# EAGLE design FM-Super-Regen (EAGLE 7.7.0)
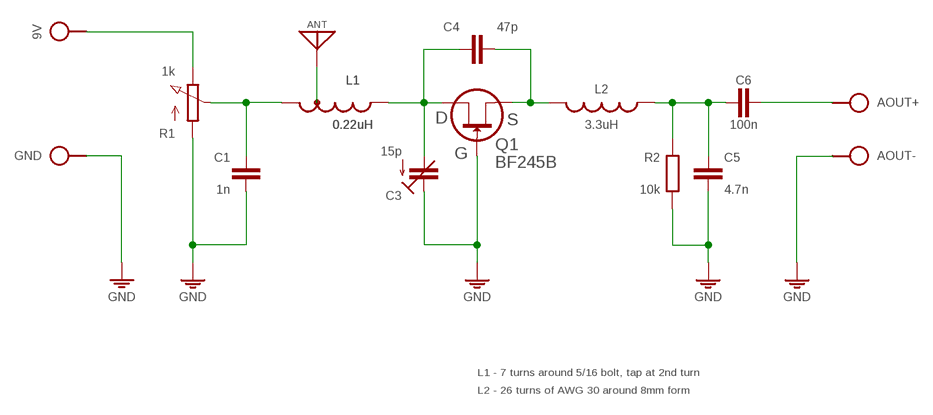
[diagram p0: schematic, sheet 1]

## Parts
9V  SPAD  [SPAD]
ANT  ANT  [SPAD]
AOUT+  SPAD  [SPAD]
AOUT-  SPAD  [SPAD]
C1  1n  C050-020X036/V  [C050-020X036/V]
C3  15p  C-TR-PH201272222-808-2PIN  [TRIM-2222-808]
C4  47p  C025-015X024  [C025-015X024]
C5  4.7n  C050-020X036  [C050-020X036]
C6  100n  C050-020X036  [C050-020X036]
GND  SPAD  [SPAD]
L1  0.22uH  L-TAP108/7V  [L-08/7V-TAP1]
L2  3.3uH  L-BODY  [L-BODY]
Q1  BF245B  [TO92]
R1  1k  POT-V  [POT-V]
R2  10k  R0204/10  [0204/10]

## Nets
GND: AOUT-.1 C1.2 C3.1(E) C5.2 GND.1 Q1.1(G) R1.A R2.1
N$1: 9V.1 R1.E
N$2: C3.2(A) C4.1 L1.2 Q1.3(D)
N$3: C1.1 L1.1 R1.S
N$4: ANT.1 L1.T
N$5: C4.2 L2.3 Q1.2(S)
N$6: C5.1 C6.1 L2.4 R2.2
N$8: AOUT+.1 C6.2

## Notes on the sheet
- L1 - 7 turns around 5/16 bolt, tap at 2nd turn
- L2 - 26 turns of AWG 30 around 8mm form

## Library data of the parts
9V AOUT+ AOUT- GND = pad:SPAD
ANT = pad:ANT
C1 C4-C6 = c:C: CAPACITOR, European symbol
C3 = cap-trim:C-TR-PH20127
L1 = l:L-TAP1
L2 = l:L: Potentiometers Beckman, Copal, Piher, Spectrol, Schukat Created by librarian@cadsoft.de
Q1 = t:BF245B: Transistors
R1 = r:POT
R2 = r:R: RESISTOR, European symbol

## Net classes
0 default: width 0.61 mm

## Board
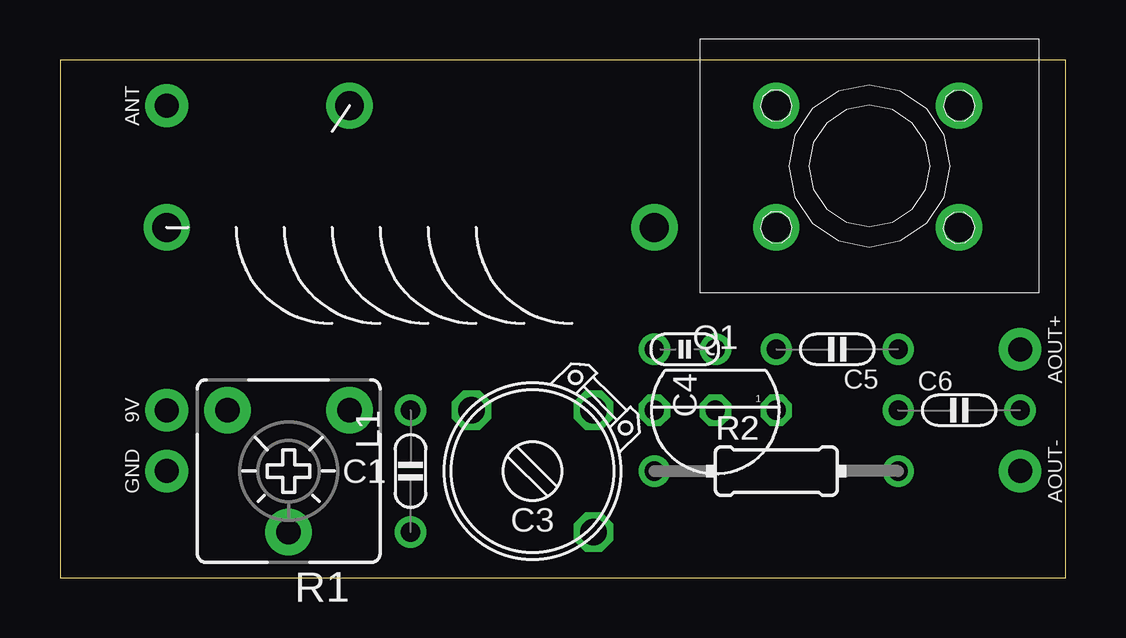
[diagram p1: board, top side]
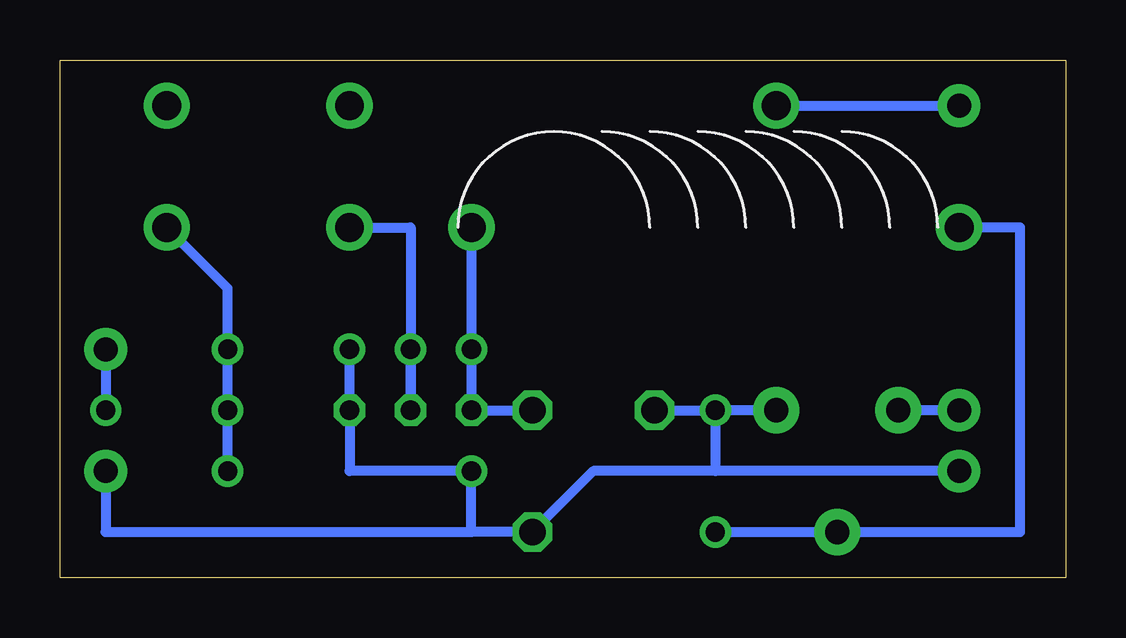
[diagram p2: board, bottom side, seen from below]

Size 41.91 x 21.59 mm. Coordinates in mm from the lower left corner, seen from the top.
Outline: 0,0 41.91,0 41.91,21.59 0,21.59 0,0
Copper layers (1*16): Top 0.035mm / dielectric 1.5mm / Bottom 0.035mm
Design rules "default": minimum track width 10mil, minimum drill 24mil, track to track 8mil, track to pad 8mil, pad to pad 8mil, via to via 8mil, smd to smd 8mil, copper to edge 40mil, drill to drill 8mil, minimum pad ring 10mil, minimum via ring 8mil, stop-mask expansion 4mil, vias tented up to drill 0mil, thermal gap 10mil

### Footprints (pad centres in the part's own frame; a part is rotated, then mirrored left to right if it is on the bottom)
SPAD = drill 1 pad 1.778: 1 0,0
C050-020X036/V = drill 0.8: 1 0,-2.54; 2 0,2.54
TRIM-2222-808 = drill 1.1 octagon: 1 -2.54,2.54; 2 -2.54,-2.54; 3 2.54,-2.54
C025-015X024 = drill 0.8: 1 0,1.27; 2 0,-1.27
C050-020X036 = drill 0.8: 1 -2.54,0; 2 2.54,0
L-08/7V-TAP1 = drill 1.2 pad 1.93: 1 0,10.16; 2 0,-10.16; T 5.08,2.54
L-BODY = drill 1.2 pad 1.93: 1 -3.81,2.54; 2 3.81,2.54; 3 -3.81,-2.54; 4 3.81,-2.54
TO92 = drill 0.8 octagon: 1 -2.54,0; 2 0,0; 3 2.54,0
POT-V = drill 1.016 pad 1.93: A -2.54,-2.54; E 2.54,-2.54; S 0,2.54
0204/10 = drill 0.8: 1 -5.08,0; 2 5.08,0

### Placement (x,y rotation side)
9V  4.45,6.99 0 top
ANT  4.45,19.68 0 top
AOUT+  40.01,9.53 180 top
AOUT-  40.01,4.45 180 top
C1  14.61,4.45 0 top
C3  19.68,4.45 180 top
C4  26.04,9.53 90 top
C5  32.39,9.53 180 top
C6  37.47,6.99 0 top
GND  4.45,4.45 0 top
L1  14.61,14.61 90 top
L2  33.66,17.14 0 top
Q1  27.3,6.99 180 top
R1  9.53,4.45 180 top
R2  29.84,4.45 0 top

### Tracks (layer width: path | path; a pad name or v marks a point on that pad's centre or on a via)
GND
  Bottom 0.406: 24.76,1.91 C3.1 19.68,4.45 14.61,4.45 | R1.A C1.2 | GND.1 14.61,4.45 | 17.14,6.99 C1.2 | C1.2 14.61,4.45 | AOUT-.1 40.01,1.91 24.76,1.91 | 24.76,1.91 R2.1 29.84,4.45 Q1.1 C5.2
N$1
  Bottom 0.406: 9V.1 R1.E
N$2
  Bottom 0.406: L1.2 Q1.3 | C4.1 Q1.3 | Q1.3 C3.2
N$3
  Bottom 0.406: C1.1 R1.S 1.91,1.91 1.91,14.61 L1.1
N$4
  Bottom 0.406: L1.T ANT.1
N$5
  Bottom 0.406: L2.3 27.3,14.61 Q1.2 C4.2
N$6
  Bottom 0.406: R2.2 C5.1 | C6.1 C5.1 | C5.1 34.93,12.06 L2.4
N$8
  Bottom 0.406: AOUT+.1 C6.2